# Altium schematic sheet AMU-S13-V00-BSPDShutdownRelay.SchDoc: Shutdown Relay
size A3; DrawnBy: Jonn Dillon; DocumentNumber: 9; Revision: 01; SheetNumber: 12; SheetTotal: 25
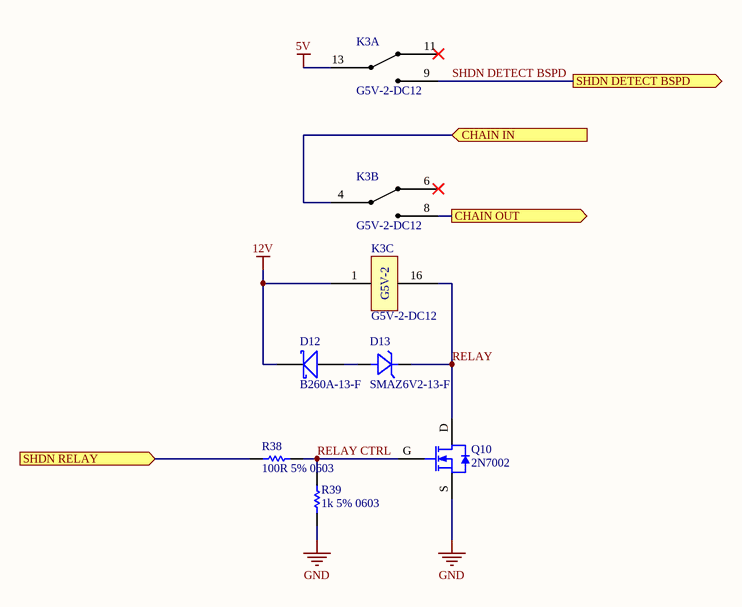
[diagram p0: AMU-S13-V00-BSPDShutdownRelay.SchDoc]

## Parts
D12  B260A-13-F  [SMA]
D13  SMAZ6V2-13-F  [SMA]
K3  G5V-2-DC12  [G5V-2]  (parts A,B,C of 3)
Q10  2N7002  [SOT23-3]
R38  100R 5% 0603  [Res_ThinFilm_0603]
R39  1k 5% 0603  [Res_ThinFilm_0603]

## Ports
CHAIN IN (in), CHAIN OUT (out), SHDN DETECT BSPD (out), SHDN RELAY (in)

## Nets
5V: K3.13
12V: D12.K K3.1
GND: Q10.S R39.1
CHAIN IN: K3.4 ; port CHAIN IN
CHAIN OUT: K3.8 ; port CHAIN OUT
RELAY: D13.K(Cathode) K3.16 Q10.D
RELAY CTRL: Q10.G R38.2 R39.2
SHDN DETECT BSPD: K3.9 ; port SHDN DETECT BSPD
SHDN RELAY: R38.1 ; port SHDN RELAY
NetD12_A: D12.A D13.A(Anode)

Not connected (* = marked no-connect by the designer): K3 6* 11*

## Notes on the sheet
- Revision History:
- Sheet Title:
- Rev
- Date
- Description
- Project:
- Size:
- Drawn By:
- A3
- Number:
- Revision:
- Sheet
- Version:
- of
- QUT Motorsport
- O-120, Gardens Point
- 2 George Street
- Brisbane, QLD 4000
- Australia
- Print Date:
- Print Time:
- File Name:
- (in symbol G5V-2-DC12, part C) G5V-2

## Library data of the parts
D12 = B260A-13-F: Diode, Schottky Barrier Rectifier, 60 V, 2 A, B260A-13-F
D13 = SMAZ6V2-13-F: Zener Diode 6.2V 1W ±5% Surface Mount SMA; Manufacturer: Generic; MPN: 5V6 500mW SMA
K3 = G5V-2-DC12: General Purpose Relay DPDT (2 Form C) Through Hole, 12V, 2A
R38 = 100R 5%, 0603: Resistor, SMD, 100R, 0.1W, 5%, 0603
R39 = 1k 5% 0603: Resistor, SMD, 1k, 0.1W, 5%, 0603